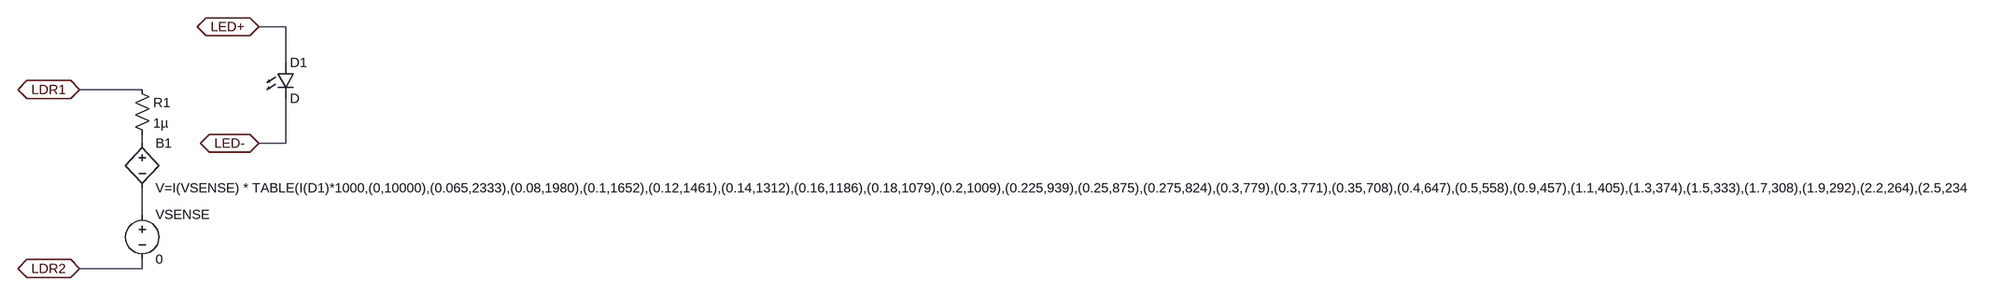
[diagram p0: schematic lcr-0203.asc]
lcr-0203.asc, the LTspice schematic file:
Version 4
SHEET 1 4920 680
WIRE 800 -160 752 -160
WIRE 800 -96 800 -160
WIRE 544 -48 432 -48
WIRE 544 48 544 32
WIRE 800 48 800 -32
WIRE 800 48 752 48
WIRE 544 176 544 128
WIRE 544 272 544 256
WIRE 544 272 432 272
FLAG 752 -160 LED+
IOPIN 752 -160 BiDir
FLAG 752 48 LED-
IOPIN 752 48 BiDir
FLAG 432 -48 LDR1
IOPIN 432 -48 BiDir
FLAG 432 272 LDR2
IOPIN 432 272 BiDir
SYMBOL voltage 544 160 R0
SYMATTR InstName VSENSE
SYMATTR Value 0
SYMBOL bv 544 32 R0
SYMATTR InstName B1
SYMATTR Value V=I(VSENSE) * TABLE(I(D1)*1000,(0,10000),(0.065,2333),(0.08,1980),(0.1,1652),(0.12,1461),(0.14,1312),(0.16,1186),(0.18,1079),(0.2,1009),(0.225,939),(0.25,875),(0.275,824),(0.3,779),(0.3,771),(0.35,708),(0.4,647),(0.5,558),(0.9,457),(1.1,405),(1.3,374),(1.5,333),(1.7,308),(1.9,292),(2.2,264),(2.5,234.7),(3.2,214),(4.3,186),(5.5,162.1),(8,142),(15.3,107.2),(25,50),(40, 50))
SYMBOL LED 784 -96 R0
SYMATTR InstName D1
SYMBOL res 528 -64 R0
SYMATTR InstName R1
SYMATTR Value 1µ

The netlist it stands for:
* lcr-0203.asc
VSENSE N002 LDR2 0
B1 N001 N002 V=I(VSENSE) * TABLE(I(D1)*1000,(0,10000),(0.065,2333),(0.08,1980),(0.1,1652),(0.12,1461),(0.14,1312),(0.16,1186),(0.18,1079),(0.2,1009),(0.225,939),(0.25,875),(0.275,824),(0.3,779),(0.3,771),(0.35,708),(0.4,647),(0.5,558),(0.9,457),(1.1,405),(1.3,374),(1.5,333),(1.7,308),(1.9,292),(2.2,264),(2.5,234.7),(3.2,214),(4.3,186),(5.5,162.1),(8,142),(15.3,107.2),(25,50),(40, 50))
D1 LED+ LED- D
R1 LDR1 N001 1µ
.model D D
.lib standard.dio
.backanno
.end